# Altium schematic sheet A3010_4MB.SchDoc
size 297 x 210 mm
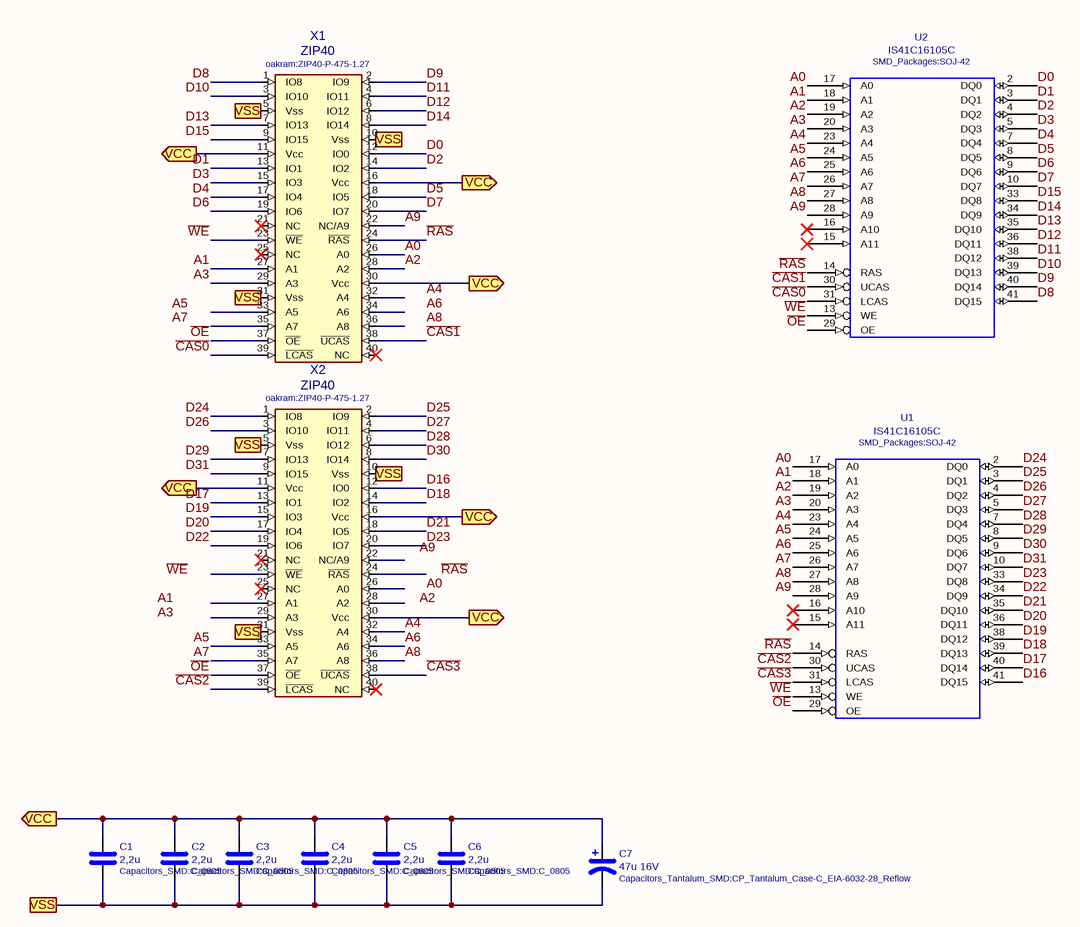
[diagram p0: A3010_4MB.SchDoc]

## Parts
C1  Footprint: Capacitors_SMD:C_0805  [C_0805]  (hidden comment: 2,2u)
C2  Footprint: Capacitors_SMD:C_0805  [C_0805]  (hidden comment: 2,2u)
C3  Footprint: Capacitors_SMD:C_0805  [C_0805]  (hidden comment: 2,2u)
C4  Footprint: Capacitors_SMD:C_0805  [C_0805]  (hidden comment: 2,2u)
C5  Footprint: Capacitors_SMD:C_0805  [C_0805]  (hidden comment: 2,2u)
C6  Footprint: Capacitors_SMD:C_0805  [C_0805]  (hidden comment: 2,2u)
C7  Footprint: Capacitors_Tantalum_SMD:CP_Tantalum_Case-C_EIA-6032-28_Reflow  [CP_Tantalum_Case-C_EIA-6032-28_Reflow]  (hidden comment: 47u 16V)
U1  Footprint: SMD_Packages:SOJ-42  [SOJ-42]  (hidden comment: IS41C16105C)
U2  Footprint: SMD_Packages:SOJ-42  [SOJ-42]  (hidden comment: IS41C16105C)
X1  Footprint: oakram:ZIP40-P-475-1.27  [ZIP40-P-475-1.27]  (hidden comment: ZIP40)
X2  Footprint: oakram:ZIP40-P-475-1.27  [ZIP40-P-475-1.27]  (hidden comment: ZIP40)

## Ports
VCC (out), VSS

## Nets
A0: U1.17(A0) U2.17(A0) X1.26(A0)
A1: U1.18(A1) U2.18(A1) X1.27(A1)
A2: U1.19(A2) U2.19(A2) X1.28(A2)
A3: U1.20(A3) U2.20(A3) X1.29(A3)
A4: U1.23(A4) U2.23(A4) X2.32(A4)
A5: U1.24(A5) U2.24(A5) X2.33(A5)
A6: U1.25(A6) U2.25(A6) X2.34(A6)
A7: U1.26(A7) U2.26(A7) X2.35(A7)
A8: U1.27(A8) U2.27(A8) X2.36(A8)
A9: U1.28(A9) U2.28(A9) X1.22(NC/A9)
~{CAS0}: U2.31(LCAS) X1.39(~{LCAS})
~{CAS1}: U2.30(UCAS) X1.38(~{UCAS})
~{CAS2}: U1.30(UCAS) X2.39(~{LCAS})
~{CAS3}: U1.31(LCAS) X2.38(~{UCAS})
D0: U2.2(DQ0) X1.12(IO0)
D1: U2.3(DQ1) X1.13(IO1)
D2: U2.4(DQ2) X1.14(IO2)
D3: U2.5(DQ3) X1.15(IO3)
D4: U2.7(DQ4) X1.17(IO4)
D5: U2.8(DQ5) X1.18(IO5)
D6: U2.9(DQ6) X1.19(IO6)
D7: U2.10(DQ7) X1.20(IO7)
D8: U2.41(DQ15) X1.1(IO8)
D9: U2.40(DQ14) X1.2(IO9)
D10: U2.39(DQ13) X1.3(IO10)
D11: U2.38(DQ12) X1.4(IO11)
D12: U2.36(DQ11) X1.6(IO12)
D13: U2.35(DQ10) X1.7(IO13)
D14: U2.34(DQ9) X1.8(IO14)
D15: U2.33(DQ8) X1.9(IO15)
D16: U1.41(DQ15) X2.12(IO0)
D17: U1.40(DQ14) X2.13(IO1)
D18: U1.39(DQ13) X2.14(IO2)
D19: U1.38(DQ12) X2.15(IO3)
D20: U1.36(DQ11) X2.17(IO4)
D21: U1.35(DQ10) X2.18(IO5)
D22: U1.34(DQ9) X2.19(IO6)
D23: U1.33(DQ8) X2.20(IO7)
D24: U1.2(DQ0) X2.1(IO8)
D25: U1.3(DQ1) X2.2(IO9)
D26: U1.4(DQ2) X2.3(IO10)
D27: U1.5(DQ3) X2.4(IO11)
D28: U1.7(DQ4) X2.6(IO12)
D29: U1.8(DQ5) X2.7(IO13)
D30: U1.9(DQ6) X2.8(IO14)
D31: U1.10(DQ7) X2.9(IO15)
~{OE}: U1.29(OE) U2.29(OE) X1.37(~{OE}) X2.37(~{OE})
~{RAS}: U1.14(RAS) U2.14(RAS) X1.24(~{RAS})
VCC: C1.1 C2.1 C3.1 C4.1 C5.1 C6.1 C7.1 X1.11(Vcc) X1.16(Vcc) X1.30(Vcc) X2.11(Vcc) X2.16(Vcc) X2.30(Vcc) ; port VCC
VSS: C1.2 C2.2 C3.2 C4.2 C5.2 C6.2 C7.2 X1.5(Vss) X1.10(Vss) X1.31(Vss) X2.5(Vss) X2.10(Vss) X2.31(Vss) ; port VSS
~{WE}: U1.13(WE) U2.13(WE) X1.23(~{WE})

Not connected (* = marked no-connect by the designer): U1 1(VCC) 6(VCC) 15(A11)* 16(A10)* 21(VCC) 22(VSS) 37(VSS) 42(VSS); U2 1(VCC) 6(VCC) 15(A11)* 16(A10)* 21(VCC) 22(VSS) 37(VSS) 42(VSS); X1 21(NC)* 25(NC)* 32(A4) 33(A5) 34(A6) 35(A7) 36(A8) 40(NC)*; X2 21(NC)* 22(NC/A9) 23(~{WE}) 24(~{RAS}) 25(NC)* 26(A0) 27(A1) 28(A2) 29(A3) 40(NC)*

## Notes on the sheet
- Labels drawn without touching a wire or pin: A0, A1, A2, A3, A4, A5, A6, A7, A8, A9, ~{RAS}, ~{WE}
- 1
- 2
- 3
- 4
- 5
- 6
- A
- B
- C
- (c) Tim Tashpulatov 2017
- D
- Title: A3010 4MB Ram
- File: oakram.sch
- Sheet: /
- KiCad E.D.A.  kicad (5.1.4)-1
- Size: A4
- Date: 2018-04-29
- Rev: 1.0
- Id: 1/1

## Library data of the parts
C1-C6 = C: Value: 2,2u
C7 = CP1: Value: 47u 16V
U1 U2 = DRAM_1MX16_SOJ: Value: IS41C16105C
X1 X2 = ZIP40: Value: ZIP40